# EAGLE design Breakout-02 (EAGLE 6.2)
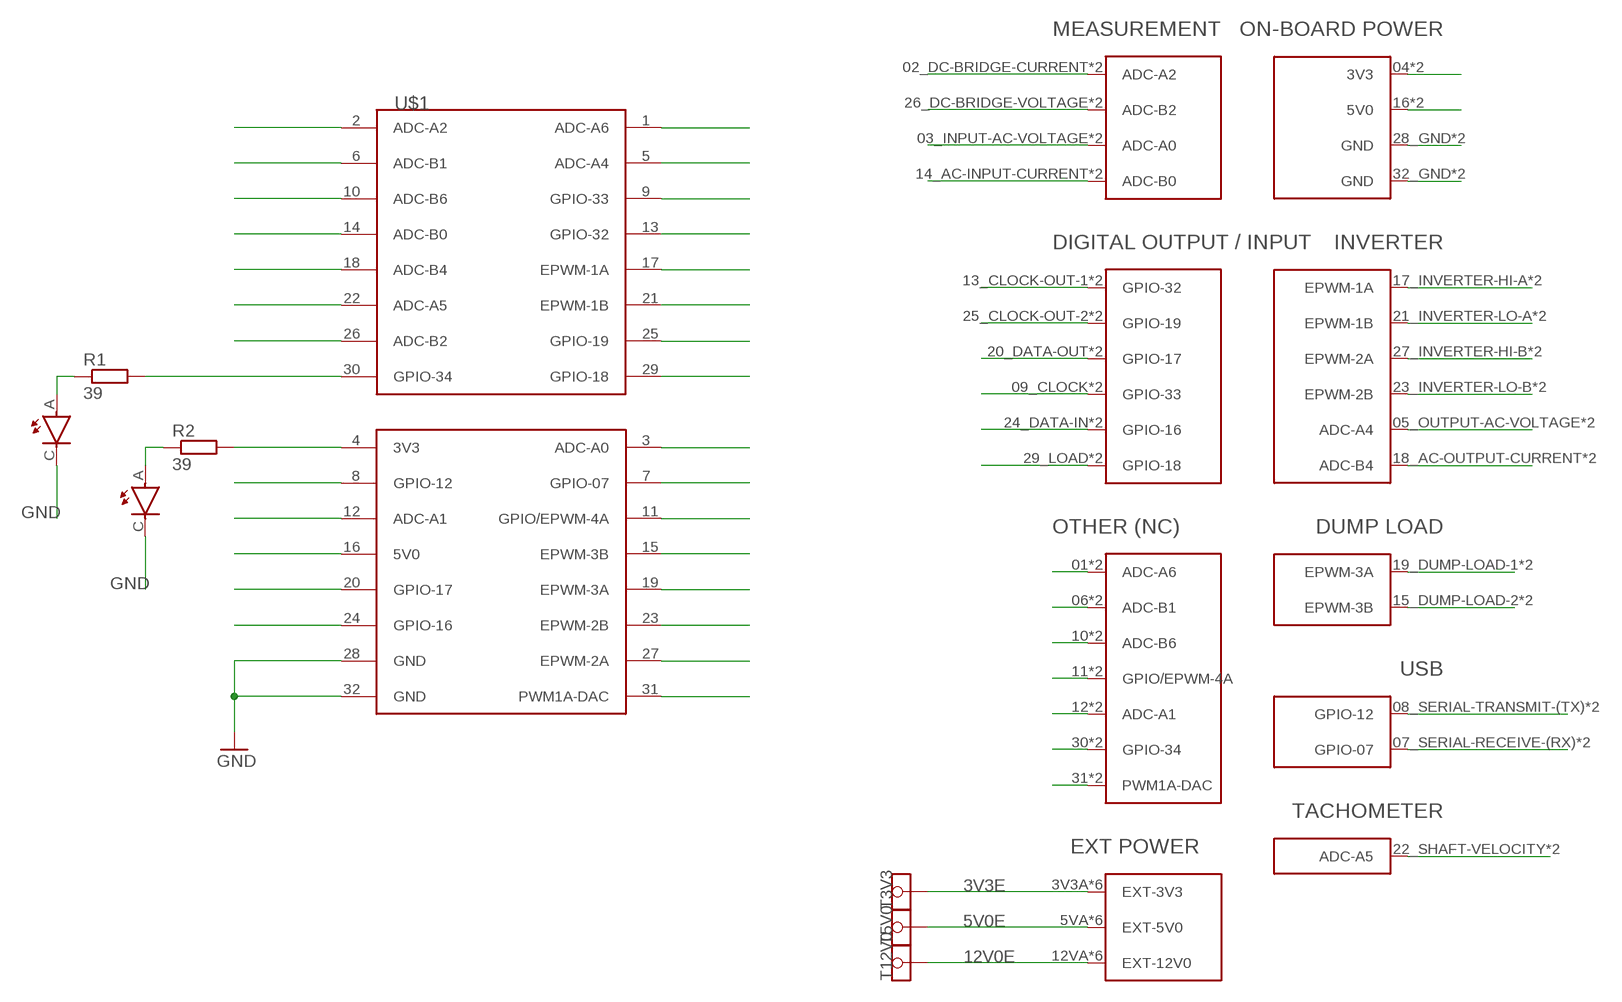
[diagram p0: schematic, sheet 1]

## Parts
GPIO34  PLCC2  [PLCC2]
PWR  PLCC2  [PLCC2]
R1  39  R-EU_R0805  [R0805]
R2  39  R-EU_R0805  [R0805]
T3V3  TESTPAD  [TESTPAD]
T5V0  TESTPAD  [TESTPAD]
T12V0  TESTPAD  [TESTPAD]
U$1  CONTROLLER_SOCKET  [CONTROLLER_SOCKET]
U$2  CONTROLLER_STACK  [CONTROLLER_STACK]

## Nets
3V3: R2.2 U$1.4(3V3) U$2.04(3V3) U$2.C4(3V3)
3V3E: T3V3.TP U$2.3V3A(EXT-3V3) U$2.3V3B(EXT-3V3) U$2.3V3C(EXT-3V3) U$2.3V3D(EXT-3V3) U$2.3V3E(EXT-3V3) U$2.3V3F(EXT-3V3)
5V0: U$1.16(5V0) U$2.16(5V0) U$2.C16(5V0)
5V0E: T5V0.TP U$2.5VA(EXT-5V0) U$2.5VB(EXT-5V0) U$2.5VC(EXT-5V0) U$2.5VD(EXT-5V0) U$2.5VE(EXT-5V0) U$2.5VF(EXT-5V0)
12V0E: T12V0.TP U$2.12VA(EXT-12V0) U$2.12VB(EXT-12V0) U$2.12VC(EXT-12V0) U$2.12VD(EXT-12V0) U$2.12VE(EXT-12V0) U$2.12VF(EXT-12V0)
ADCA0: U$1.3(ADC-A0) U$2.03_INPUT-AC-VOLTAGE(ADC-A0) U$2.C3(ADC-A0)
ADCA1: U$1.12(ADC-A1) U$2.12(ADC-A1) U$2.C12(ADC-A1)
ADCA2: U$1.2(ADC-A2) U$2.02_DC-BRIDGE-CURRENT(ADC-A2) U$2.C2(ADC-A2)
ADCA4: U$1.5(ADC-A4) U$2.05_OUTPUT-AC-VOLTAGE(ADC-A4) U$2.C5(ADC-A4)
ADCA5: U$1.22(ADC-A5) U$2.22_SHAFT-VELOCITY(ADC-A5) U$2.C22(ADC-A5)
ADCA6: U$1.1(ADC-A6) U$2.01(ADC-A6) U$2.C1(ADC-A6)
ADCB0: U$1.14(ADC-B0) U$2.14_AC-INPUT-CURRENT(ADC-B0) U$2.C14(ADC-B0)
ADCB1: U$1.6(ADC-B1) U$2.06(ADC-B1) U$2.C6(ADC-B1)
ADCB2: U$1.26(ADC-B2) U$2.26_DC-BRIDGE-VOLTAGE(ADC-B2) U$2.C26(ADC-B2)
ADCB4: U$1.18(ADC-B4) U$2.18_AC-OUTPUT-CURRENT(ADC-B4) U$2.C18(ADC-B4)
ADCB6: U$1.10(ADC-B6) U$2.10(ADC-B6) U$2.C10(ADC-B6)
EPWM1A: U$1.17(EPWM-1A) U$2.17_INVERTER-HI-A(EPWM-1A) U$2.C17(EPWM-1A)
EPWM1B: U$1.21(EPWM-1B) U$2.21_INVERTER-LO-A(EPWM-1B) U$2.C21(EPWM-1B)
EPWM2A: U$1.27(EPWM-2A) U$2.27_INVERTER-HI-B(EPWM-2A) U$2.C27(EPWM-2A)
EPWM2B: U$1.23(EPWM-2B) U$2.23_INVERTER-LO-B(EPWM-2B) U$2.C23(EPWM-2B)
EPWM3A: U$1.19(EPWM-3A) U$2.19_DUMP-LOAD-1(EPWM-3A) U$2.C19(EPWM-3A)
EPWM3B: U$1.15(EPWM-3B) U$2.15_DUMP-LOAD-2(EPWM-3B) U$2.C15(EPWM-3B)
EPWM4A: U$1.11(GPIO/EPWM-4A) U$2.11(GPIO/EPWM-4A) U$2.C11(GPIO/EPWM-4A)
GND: GPIO34.C PWR.C U$1.28(GND) U$1.32(GND) U$2.28_GND(GND) U$2.32_GND(GND) U$2.C28(GND) U$2.C32(GND)
GPIO07: U$1.7(GPIO-07) U$2.07_SERIAL-RECEIVE-(RX)(GPIO-07) U$2.C7(GPIO-07)
GPIO12: U$1.8(GPIO-12) U$2.08_SERIAL-TRANSMIT-(TX)(GPIO-12) U$2.C8(GPIO-12)
GPIO16: U$1.24(GPIO-16) U$2.24_DATA-IN(GPIO-16) U$2.C24(GPIO-16)
GPIO17: U$1.20(GPIO-17) U$2.20_DATA-OUT(GPIO-17) U$2.C20(GPIO-17)
GPIO18: U$1.29(GPIO-18) U$2.29_LOAD(GPIO-18) U$2.C29(GPIO-18)
GPIO19: U$1.25(GPIO-19) U$2.25_CLOCK-OUT-2(GPIO-19) U$2.C25(GPIO-19)
GPIO32: U$1.13(GPIO-32) U$2.13_CLOCK-OUT-1(GPIO-32) U$2.C13(GPIO-32)
GPIO33: U$1.9(GPIO-33) U$2.09_CLOCK(GPIO-33) U$2.C9(GPIO-33)
GPIO34: R1.2 U$1.30(GPIO-34) U$2.30(GPIO-34) U$2.C30(GPIO-34)
N$1: PWR.A R2.1
N$2: GPIO34.A R1.1
PWM1ADAC: U$1.31(PWM1A-DAC) U$2.31(PWM1A-DAC) U$2.C31(PWM1A-DAC)

## Library data of the parts
GPIO34 PWR = PCB_ControlStack:PLCC2
R1 R2 = resistor:R-EU_: RESISTOR, European symbol
T3V3 T5V0 T12V0 = PCB_ControlStack:TESTPAD
U$1 = PCB_ControlStack:CONTROLLER_SOCKET
U$2 = PCB_ControlStack:CONTROLLER_STACK

## Board
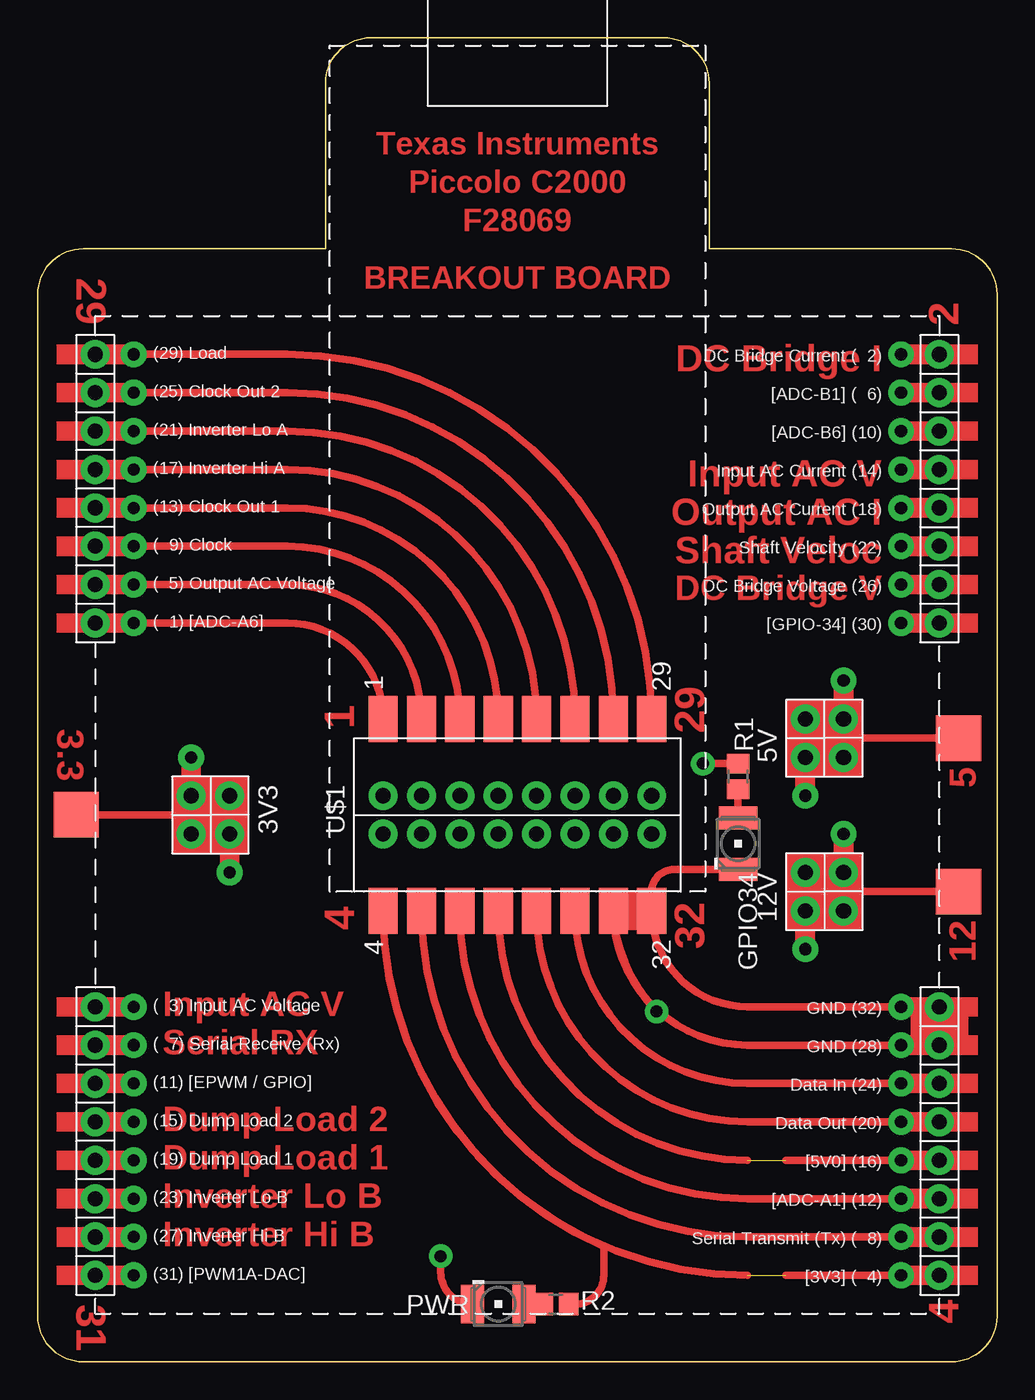
[diagram p1: board, top side]
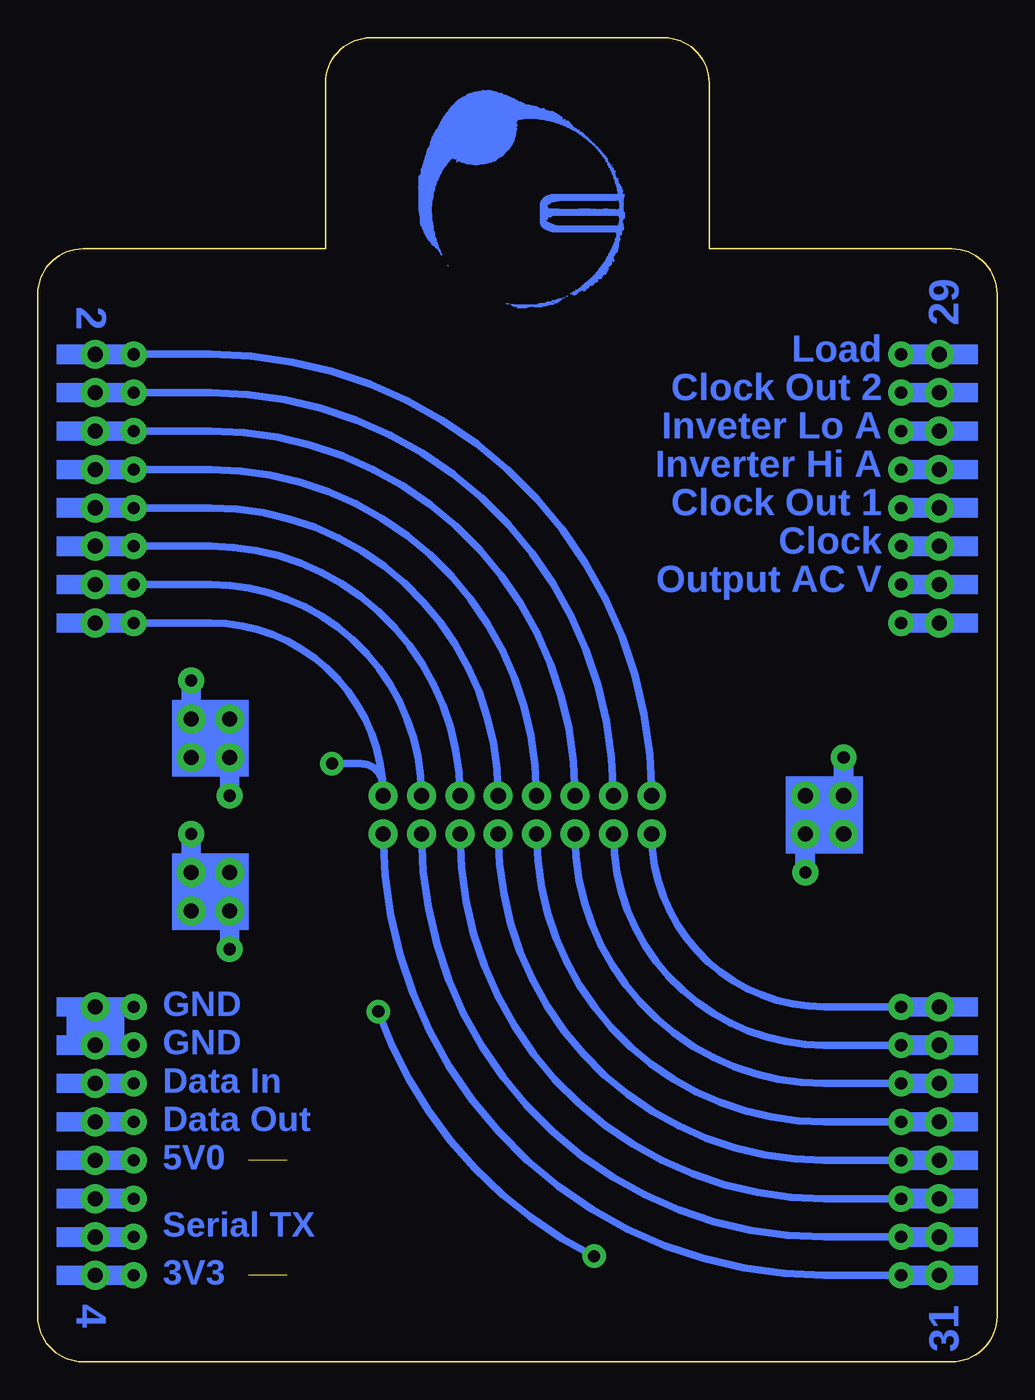
[diagram p2: board, bottom side, seen from below]

Size 63.5 x 87.63 mm. Coordinates in mm from the lower left corner, seen from the top.
Outline: 3,0 60.5,0 arc90 63.5,3 63.5,70.66 arc90 60.5,73.66 44.45,73.66 44.45,84.63 arc90 41.45,87.63 22.05,87.63 arc90 19.05,84.63 19.05,73.66 3,73.66 arc90 0,70.66 0,3 arc90 3,0
Copper layers (1*16): Top 0.035mm / dielectric 1.5mm / Bottom 0.035mm
Design rules: minimum track width 12mil, minimum drill 0.7mm, track to track 25mil, track to pad 20mil, pad to pad 15mil, via to via 20mil, smd to smd 0mil, copper to edge 40mil, drill to drill 10mil, minimum pad ring 18mil, minimum via ring 15mil, stop-mask expansion 0mil, vias tented up to drill 0mil, thermal gap 15mil
tRestrict: 16 lines
bRestrict: 16 lines

### Footprints (pad centres in the part's own frame; a part is rotated, then mirrored left to right if it is on the bottom)
PLCC2 = smd 2.54 x 1.524: A 0,1.702; C 0,-1.702
R0805 = smd 1.3 x 1.5: 1 -0.85,0; 2 0.85,0
TESTPAD = smd 3 x 3: TP 0,0
CONTROLLER_SOCKET = smd 3.048 x 1.93: 1 6.35,8.89; 4 -6.35,8.89; 5 6.35,6.35; 8 -6.35,6.35; 9 6.35,3.81; 12 -6.35,3.81; 13 6.35,1.27; 16 -6.35,1.27; 17 6.35,-1.27; 20 -6.35,-1.27; 21 6.35,-3.81; 24 -6.35,-3.81; 25 6.35,-6.35; 28 -6.35,-6.35; 29 6.35,-8.89; 32 -6.35,-8.89 | drill 1: 2 1.27,8.89; 3 -1.27,8.89; 6 1.27,6.35; 7 -1.27,6.35; 10 1.27,3.81; 11 -1.27,3.81; 14 1.27,1.27; 15 -1.27,1.27; 18 1.27,-1.27; 19 -1.27,-1.27; 22 1.27,-3.81; 23 -1.27,-3.81; 26 1.27,-6.35; 27 -1.27,-6.35; 30 1.27,-8.89; 31 -1.27,-8.89
CONTROLLER_STACK = drill 1: 01 -27.94,12.7; 02_DC-BRIDGE-CURRENT 27.94,30.48; 03_INPUT-AC-VOLTAGE -27.94,-12.7; 3V3B -21.59,-1.27; 3V3C -21.59,1.27; 3V3E -19.05,1.27; 3V3F -19.05,-1.27; 04 27.94,-30.48; 05_OUTPUT-AC-VOLTAGE -27.94,15.24; 5VB 19.05,3.81; 5VC 19.05,6.35; 5VE 21.59,6.35; 5VF 21.59,3.81; 06 27.94,27.94; 07_SERIAL-RECEIVE-(RX) -27.94,-15.24; 08_SERIAL-TRANSMIT-(TX) 27.94,-27.94; 09_CLOCK -27.94,17.78; 10 27.94,25.4; 11 -27.94,-17.78; 12 27.94,-25.4; 12VB 19.05,-6.35; 12VC 19.05,-3.81; 12VE 21.59,-3.81; 12VF 21.59,-6.35; 13_CLOCK-OUT-1 -27.94,20.32; 14_AC-INPUT-CURRENT 27.94,22.86; 15_DUMP-LOAD-2 -27.94,-20.32; 16 27.94,-22.86; 17_INVERTER-HI-A -27.94,22.86; 18_AC-OUTPUT-CURRENT 27.94,20.32; 19_DUMP-LOAD-1 -27.94,-22.86; 20_DATA-OUT 27.94,-20.32; 21_INVERTER-LO-A -27.94,25.4; 22_SHAFT-VELOCITY 27.94,17.78; 23_INVERTER-LO-B -27.94,-25.4; 24_DATA-IN 27.94,-17.78; 25_CLOCK-OUT-2 -27.94,27.94; 26_DC-BRIDGE-VOLTAGE 27.94,15.24; 27_INVERTER-HI-B -27.94,-27.94; 28_GND 27.94,-15.24; 29_LOAD -27.94,30.48; 30 27.94,12.7; 31 -27.94,-30.48; 32_GND 27.94,-12.7 | drill 0.8: 3V3A -21.59,3.81; 3V3D -19.05,-3.81; 5VA 19.05,1.27; 5VD 21.59,8.89; 12VA 19.05,-8.89; 12VD 21.59,-1.27; C1 -25.4,12.7; C2 25.4,30.48; C3 -25.4,-12.7; C4 25.4,-30.48; C5 -25.4,15.24; C6 25.4,27.94; C7 -25.4,-15.24; C8 25.4,-27.94; C9 -25.4,17.78; C10 25.4,25.4; C11 -25.4,-17.78; C12 25.4,-25.4; C13 -25.4,20.32; C14 25.4,22.86; C15 -25.4,-20.32; C16 25.4,-22.86; C17 -25.4,22.86; C18 25.4,20.32; C19 -25.4,-22.86; C20 25.4,-20.32; C21 -25.4,25.4; C22 25.4,17.78; C23 -25.4,-25.4; C24 25.4,-17.78; C25 -25.4,27.94; C26 25.4,15.24; C27 -25.4,-27.94; C28 25.4,-15.24; C29 -25.4,30.48; C30 25.4,12.7; C31 -25.4,-30.48; C32 25.4,-12.7

### Placement (x,y rotation side)
GPIO34  46.35,34.29 0 top
PWR  30.48,3.81 270 top
R1  46.35,38.73 90 top
R2  34.29,3.81 0 top
T3V3  2.54,36.2 90 top
T5V0  60.96,41.27 270 top
T12V0  60.96,31.11 270 top
U$1  31.75,36.2 90 top
U$2  31.75,36.2 0 top

### Tracks (layer width: path | path; a pad name or v marks a point on that pad's centre or on a via)
3V3  (1 unrouted)
  Top 0.5: U$2.C4 U$2.04 49.53,5.71 | 46.99,5.71 arc-90 U$1.4 arc66 37.47,7.62 37.47,5.71 arc-90 35.56,3.81 R2.2
3V3E
  Top 0.5: U$2.3V3A U$2.3V3C | U$2.3V3D U$2.3V3F U$2.3V3E U$2.3V3C | U$2.3V3C 10.16,36.2 | 10.16,36.2 U$2.3V3B | T3V3.TP 10.16,36.2
5V0  (1 unrouted)
  Top 0.5: U$2.16 U$2.C16 49.53,13.34 | 46.99,13.34 arc-90 U$1.16
5V0E
  Top 0.5: U$2.5VD U$2.5VE | U$2.5VA U$2.5VB U$2.5VF 53.34,41.27 | 53.34,41.27 U$2.5VE | U$2.5VE U$2.5VC | T5V0.TP 53.34,41.27
12V0E
  Top 0.5: U$2.12VA U$2.12VB U$2.12VC U$2.12VE | U$2.12VE U$2.12VD | U$2.12VF 53.34,31.11 | U$2.12VE 53.34,31.75 53.34,31.11 | T12V0.TP 53.34,31.11
ADCA0
  Bottom 0.5: U$2.03_INPUT-AC-VOLTAGE U$2.C3 11.43,23.5 arc90 U$1.3
ADCA1
  Top 0.5: U$2.12 U$2.C12 46.99,10.79 arc-90 U$1.12
ADCA2
  Bottom 0.5: U$2.02_DC-BRIDGE-CURRENT U$2.C2 52.07,66.67 arc90 U$1.2
ADCA4
  Top 0.5: U$2.05_OUTPUT-AC-VOLTAGE U$2.C5 16.51,51.44 arc-90 U$1.5
ADCA5
  Bottom 0.5: U$2.22_SHAFT-VELOCITY U$2.C22 52.07,53.98 arc90 U$1.22
ADCA6
  Top 0.5: U$2.01 U$2.C1 16.51,48.9 arc-90 U$1.1
ADCB0
  Bottom 0.5: U$2.14_AC-INPUT-CURRENT U$2.C14 52.07,59.05 arc90 U$1.14
ADCB1
  Bottom 0.5: U$2.06 U$2.C6 52.07,64.14 arc90 U$1.6
ADCB2
  Bottom 0.5: U$2.26_DC-BRIDGE-VOLTAGE U$2.C26 52.07,51.44 arc90 U$1.26
ADCB4
  Bottom 0.5: U$2.18_AC-OUTPUT-CURRENT U$2.C18 52.07,56.52 arc90 U$1.18
ADCB6
  Bottom 0.5: U$2.10 U$2.C10 52.07,61.59 arc90 U$1.10
EPWM1A
  Top 0.5: U$2.17_INVERTER-HI-A U$2.C17 16.51,59.05 arc-90 U$1.17
EPWM1B
  Top 0.5: U$2.21_INVERTER-LO-A U$2.C21 16.51,61.59 arc-90 U$1.21
EPWM2A
  Bottom 0.5: U$2.27_INVERTER-HI-B U$2.C27 11.43,8.26 arc90 U$1.27
EPWM2B
  Bottom 0.5: U$2.23_INVERTER-LO-B U$2.C23 11.43,10.79 arc90 U$1.23
EPWM3A
  Bottom 0.5: U$2.19_DUMP-LOAD-1 U$2.C19 11.43,13.34 arc90 U$1.19
EPWM3B
  Bottom 0.5: U$2.15_DUMP-LOAD-2 U$2.C15 11.43,15.88 arc90 U$1.15
EPWM4A
  Bottom 0.5: U$2.11 U$2.C11 11.43,18.41 arc90 U$1.11
GND  (via drill 0.8)
  Top 0.5: U$1.32 arc90 46.99,23.5 U$2.C32 U$2.32_GND U$2.28_GND U$2.C28 46.99,20.95 arc-90 U$1.28 | GPIO34.C 42.11,32.59 arc90 40.64,31.11 U$1.32 | U$1.32 U$1.28 | U$1.28 38.1,29.21 arc35 v40.96,23.18 | v26.67,6.99 26.67,5.92 arc90 PWR.C
  Bottom 0.5: v40.96,23.18 arc-44 v26.67,6.99
GPIO07
  Bottom 0.5: U$2.07_SERIAL-RECEIVE-(RX) U$2.C7 11.43,20.95 arc90 U$1.7
GPIO12
  Top 0.5: U$2.08_SERIAL-TRANSMIT-(TX) U$2.C8 46.99,8.26 arc-90 U$1.8
GPIO16
  Top 0.5: U$2.24_DATA-IN U$2.C24 46.99,18.41 arc-90 U$1.24
GPIO17
  Top 0.5: U$2.20_DATA-OUT U$2.C20 46.99,15.88 arc-90 U$1.20
GPIO18
  Top 0.5: U$2.29_LOAD U$2.C29 16.51,66.67 arc-90 U$1.29
GPIO19
  Top 0.5: U$2.25_CLOCK-OUT-2 U$2.C25 16.51,64.14 arc-90 U$1.25
GPIO32
  Top 0.5: U$2.13_CLOCK-OUT-1 U$2.C13 16.51,56.52 arc-90 U$1.13
GPIO33
  Top 0.5: U$2.09_CLOCK U$2.C9 16.51,53.98 arc-90 U$1.9
GPIO34  (via drill 0.8)
  Top 0.5: R1.2 v44.03,39.59
  Bottom 0.5: U$2.30 U$2.C30 52.07,48.9 arc90 U$1.30 40.64,38.1 arc-90 42.12,39.59 v44.03,39.59
N$1
  Top 0.5: PWR.A R2.1
N$2
  Top 0.5: GPIO34.A R1.1
PWM1ADAC
  Bottom 0.5: U$2.31 U$2.C31 11.43,5.71 arc90 U$1.31
(copper drawn outside any net)
  shapes: Bottom area x1035, Top area x2

### Text on the board
Top: Texas Instruments | Piccolo C2000 | F28069 | BREAKOUT BOARD | DC Bridge I | Input AC V | Output AC I | Shaft Veloc | DC Bridge V | 3.3 | 1 | 29 | 5 | 4 | 12 | 32 | Input AC V | Serial RX | Dump Load 2 | Dump Load 1 | Inverter Lo B | Inverter Hi B
Bottom: Load | Clock Out 2 | Inveter Lo A | Inverter Hi A | Clock Out 1 | Clock | Output AC V | GND | GND | Data In | Data Out | 5V0 | Serial TX | 3V3